# Altium project REL_IRF_MEZ.PrjPCB
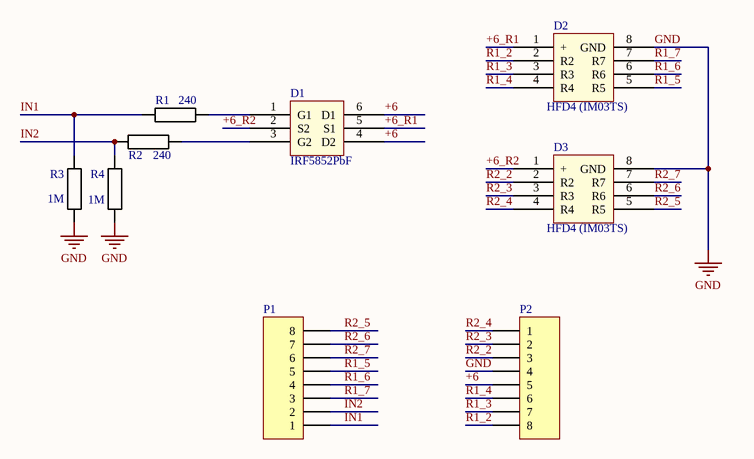
[diagram p0: REL_IRF_MEZ.SchDoc]
1 sheet, 9 parts. Net scope: global (net labels, ports and power ports of the same name join across sheets).
Board file: REL_IRF_MEZ_v2.PcbDoc

## Sheet REL_IRF_MEZ.SchDoc
size A4

### Parts
D1  IRF5852PbF  [IRF5852PbF]
D2  HFD4 (IM03TS)  [HFD4 (IM03TS)]
D3  HFD4 (IM03TS)  [HFD4 (IM03TS)]
P1  Header 8  [HDR1X8]  (value not drawn)
P2  Header 8  [HDR1X8]  (value not drawn)
R1  240  [RES_1206]
R2  240  [RES_1206]
R3  1М  [RES_1206]
R4  1М  [RES_1206]

### Nets
GND: D2.8(GND) D3.8(GND) P2.4 R3.2 R4.1
+6: D1.4(D2) D1.6(D1) P2.5
+6_R1: D1.5(S1) D2.1(+)
+6_R2: D1.2(S2) D3.1(+)
IN1: P1.1 R1.1 R3.1
IN2: P1.2 R2.1 R4.2
R1_2: D2.2(R2) P2.8
R1_3: D2.3(R3) P2.7
R1_4: D2.4(R4) P2.6
R1_5: D2.5(R5) P1.5
R1_6: D2.6(R6) P1.4
R1_7: D2.7(R7) P1.3
R2_2: D3.2(R2) P2.3
R2_3: D3.3(R3) P2.2
R2_4: D3.4(R4) P2.1
R2_5: D3.5(R5) P1.8
R2_6: D3.6(R6) P1.7
R2_7: D3.7(R7) P1.6
NetD1_1: D1.1(G1) R1.2
NetD1_3: D1.3(G2) R2.2

### Library data of the parts
P1 P2 = Header 8: Header, 8-Pin; LatestRevisionDate: 17-Jul-2002; LatestRevisionNote: Re-released for DXP Platform.; Publisher: Altium Limited
R1-R4 = RES